# Altium schematic sheet PWR_1117.SchDoc
size A3; SheetNumber: 8; SheetTotal: 10
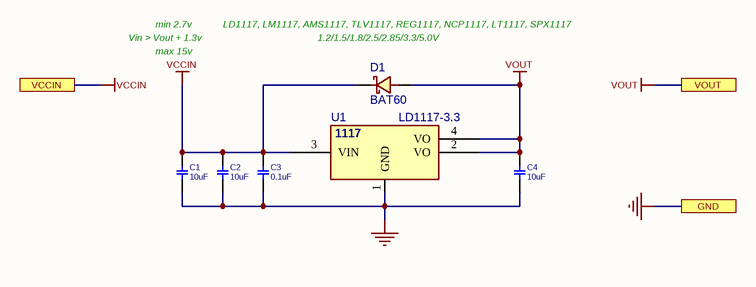
[diagram p0: PWR_1117.SchDoc]

## Parts
C1  10uF  [C0805]
C2  10uF  [C0805]
C3  0.1uF  [C0603]
C4  10uF  [C0805]
D1  BAT60  [D_SOD323]
U1  LD1117-3.3  [SOT223_4]

## Ports
GND, VCCIN, VOUT

## Nets
GND: C1.2 C2.2 C3.1 C4.2 U1.1(GND) ; port GND
VCCIN: C1.1 C2.1 C3.2 D1.2 U1.3(VIN) ; port VCCIN
VOUT: C4.1 D1.1 U1.2(VO) U1.4(VO) ; port VOUT

## Notes on the sheet
- min 2.7v
- LD1117, LM1117, AMS1117, TLV1117, REG1117, NCP1117, LT1117, SPX1117
- Vin > Vout + 1.3v
- max 15v
- (near D1) 1.2/1.5/1.8/2.5/2.85/3.3/5.0V
- (in symbol VREG_1117_SOT223) 1117

## Library data of the parts
C1 C2 C4 = CAP_SMD_MLCC_1206: CAP, MLCC, -F, -V, MATERIAL, -%, 1206; PARAM: -, -%; MANF_P#: MANF_PART#; PRICE: 100= 1$; MANF: -; PARAM2: -V; ASSEMBLY: ASSEMBLY
C3 = CAP_SMD_MLCC_0805: CAP, MLCC, -F, -V, MATERIAL, -%, 0805; PARAM: -, -%; MANF_P#: MANF_PART#; PRICE: 100= 1$; MANF: -; PARAM2: -V; ASSEMBLY: ASSEMBLY
D1 = DIODE_SMD_SCHOTTKY_BAT60: DIODE, SCHOTTKY, 10V, 3A, 0.3Vf; MANF: Infineon; MANF_P#: BAT60AE6327HTSA1; DESC: DESCRIPTION; PARAM2: VFdrop: 0.1V@10mA, 0.22V@1A; PARAM: 3A, 1.35W, -55~85oC; ASSEMBLY: ASSEMBLY; PRICE: 0.4$; VALUE: BAT60
U1 = VREG_1117_SOT223: REG, Linear, LDO1V, 0.8A, SOT-223; MANF_P#: LD1117, LM1117, AMS1117, TLV1117, REG1117, NCP1117, LT1117, SPX1117; MANF: TI, ON, ST; PARAM2: 1.2/1.5/1.8/2.5/2.85/3.3/5V; PARAM: LDO1V, 0.8A; VALUE: LD1117-3.3